# Altium schematic sheet driver_and_mosfets.SchDoc
size A4
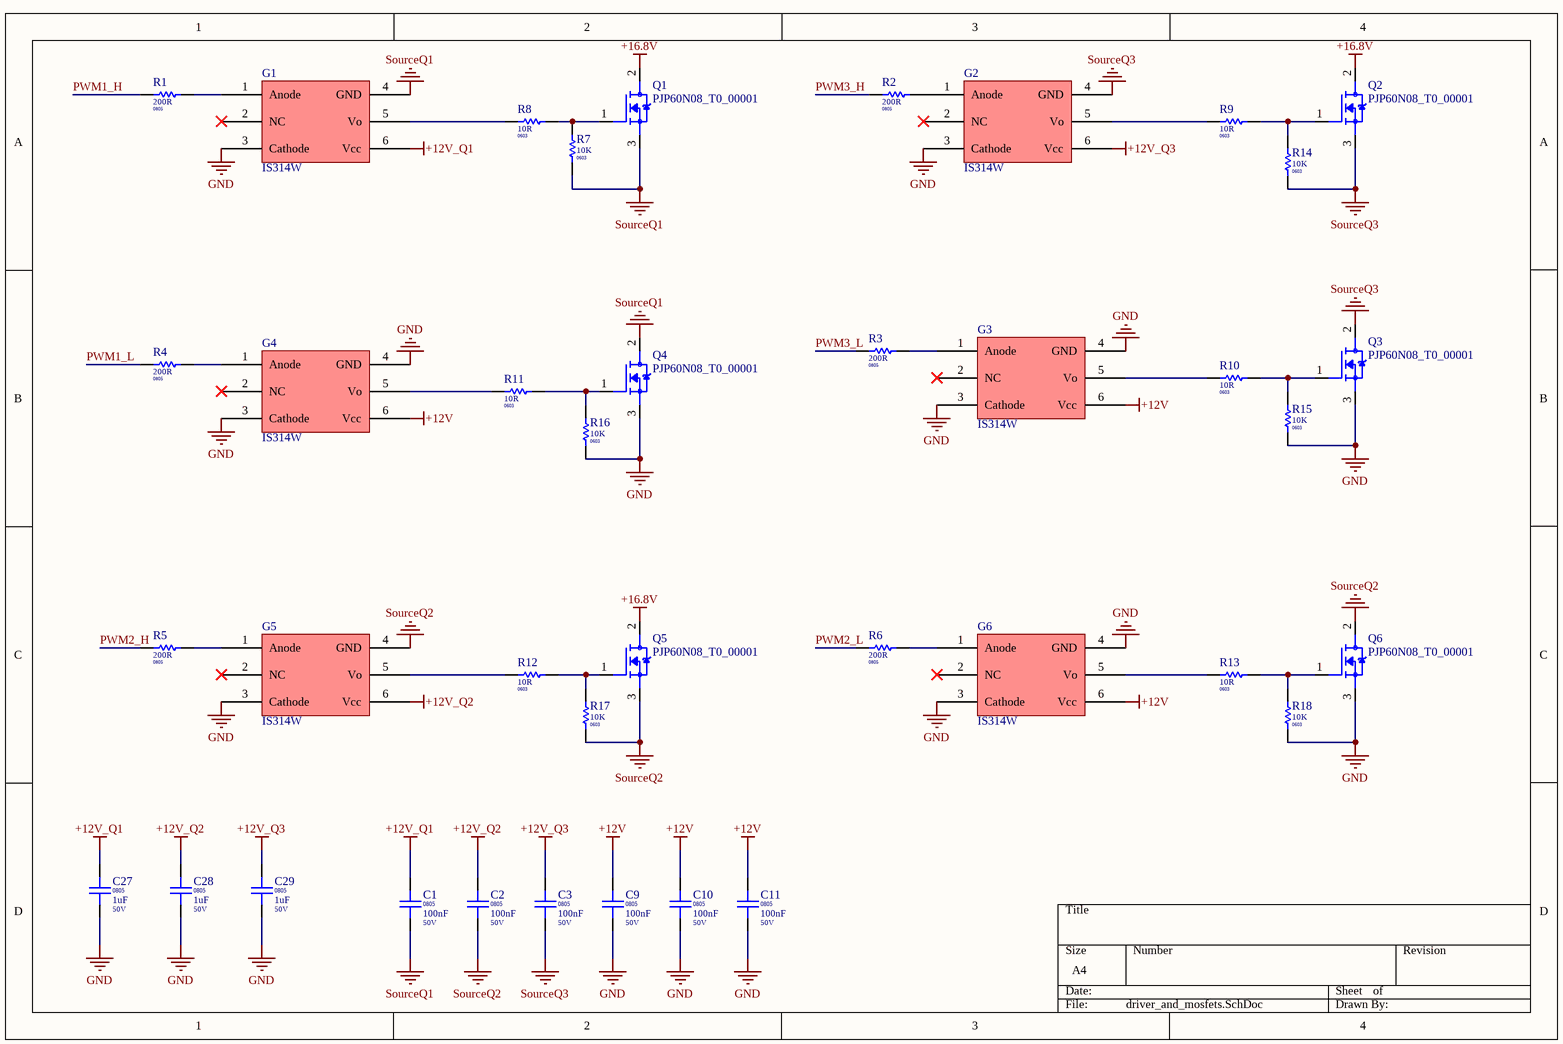
[diagram p0: driver_and_mosfets.SchDoc]

## Parts
C1  Package / Case: 0805  Voltage: 50V  [CAPC 0805]  (hidden comment: 100nF)
C2  Package / Case: 0805  Voltage: 50V  [CAPC 0805]  (hidden comment: 100nF)
C3  Package / Case: 0805  Voltage: 50V  [CAPC 0805]  (hidden comment: 100nF)
C9  Package / Case: 0805  Voltage: 50V  [CAPC 0805]  (hidden comment: 100nF)
C10  Package / Case: 0805  Voltage: 50V  [CAPC 0805]  (hidden comment: 100nF)
C11  Package / Case: 0805  Voltage: 50V  [CAPC 0805]  (hidden comment: 100nF)
C27  Package / Case: 0805  Voltage: 50V  [CAPC 0805]  (hidden comment: 1uF)
C28  Package / Case: 0805  Voltage: 50V  [CAPC 0805]  (hidden comment: 1uF)
C29  Package / Case: 0805  Voltage: 50V  [CAPC 0805]  (hidden comment: 1uF)
G1  IS314W  [SOIC127P1150X360-6N]
G2  IS314W  [SOIC127P1150X360-6N]
G3  IS314W  [SOIC127P1150X360-6N]
G4  IS314W  [SOIC127P1150X360-6N]
G5  IS314W  [SOIC127P1150X360-6N]
G6  IS314W  [SOIC127P1150X360-6N]
Q1  PJP60N08_T0_00001  [TO-220-3]
Q2  PJP60N08_T0_00001  [TO-220-3]
Q3  PJP60N08_T0_00001  [TO-220-3]
Q4  PJP60N08_T0_00001  [TO-220-3]
Q5  PJP60N08_T0_00001  [TO-220-3]
Q6  PJP60N08_T0_00001  [TO-220-3]
R1  Package / Case: 0805  [RESC 0805]  (hidden comment: 200R)
R2  Package / Case: 0805  [RESC 0805]  (hidden comment: 200R)
R3  Package / Case: 0805  [RESC 0805]  (hidden comment: 200R)
R4  Package / Case: 0805  [RESC 0805]  (hidden comment: 200R)
R5  Package / Case: 0805  [RESC 0805]  (hidden comment: 200R)
R6  Package / Case: 0805  [RESC 0805]  (hidden comment: 200R)
R7  Package / Case: 0603  [RESC 0603]  (hidden comment: 10K)
R8  Package / Case: 0603  [RESC 0603]  (hidden comment: 10R)
R9  Package / Case: 0603  [RESC 0603]  (hidden comment: 10R)
R10  Package / Case: 0603  [RESC 0603]  (hidden comment: 10R)
R11  Package / Case: 0603  [RESC 0603]  (hidden comment: 10R)
R12  Package / Case: 0603  [RESC 0603]  (hidden comment: 10R)
R13  Package / Case: 0603  [RESC 0603]  (hidden comment: 10R)
R14  Package / Case: 0603  [RESC 0603]  (hidden comment: 10K)
R15  Package / Case: 0603  [RESC 0603]  (hidden comment: 10K)
R16  Package / Case: 0603  [RESC 0603]  (hidden comment: 10K)
R17  Package / Case: 0603  [RESC 0603]  (hidden comment: 10K)
R18  Package / Case: 0603  [RESC 0603]  (hidden comment: 10K)

## Nets
+12V: C9.2 C10.2 C11.2 G3.6(Vcc) G4.6(Vcc) G6.6(Vcc)
+12V_Q1: C1.2 C27.2 G1.6(Vcc)
+12V_Q2: C2.2 C28.2 G5.6(Vcc)
+12V_Q3: C3.2 C29.2 G2.6(Vcc)
+16.8V: Q1.2(D) Q2.2(D) Q5.2(D)
GND: C9.1 C10.1 C11.1 C27.1 C28.1 C29.1 G1.3(Cathode) G2.3(Cathode) G3.3(Cathode) G3.4(GND) G4.3(Cathode) G4.4(GND) G5.3(Cathode) G6.3(Cathode) G6.4(GND) Q3.3(S) Q4.3(S) Q6.3(S) R15.1 R16.1 R18.1
SourceQ1: C1.1 G1.4(GND) Q1.3(S) Q4.2(D) R7.1
SourceQ2: C2.1 G5.4(GND) Q5.3(S) Q6.2(D) R17.1
SourceQ3: C3.1 G2.4(GND) Q2.3(S) Q3.2(D) R14.1
PWM1_H: R1.1
PWM1_L: R4.1
PWM2_H: R5.1
PWM2_L: R6.1
PWM3_H: R2.1
PWM3_L: R3.1
NetG1_1: G1.1(Anode) R1.2
NetG1_5: G1.5(Vo) R8.1
NetG2_1: G2.1(Anode) R2.2
NetG2_5: G2.5(Vo) R9.1
NetG3_1: G3.1(Anode) R3.2
NetG3_5: G3.5(Vo) R10.1
NetG4_1: G4.1(Anode) R4.2
NetG4_5: G4.5(Vo) R11.1
NetG5_1: G5.1(Anode) R5.2
NetG5_5: G5.5(Vo) R12.1
NetG6_1: G6.1(Anode) R6.2
NetG6_5: G6.5(Vo) R13.1
NetQ1_1: Q1.1(G) R7.2 R8.2
NetQ2_1: Q2.1(G) R9.2 R14.2
NetQ3_1: Q3.1(G) R10.2 R15.2
NetQ4_1: Q4.1(G) R11.2 R16.2
NetQ5_1: Q5.1(G) R12.2 R17.2
NetQ6_1: Q6.1(G) R13.2 R18.2

Not connected (* = marked no-connect by the designer): G1 2(NC)*; G2 2(NC)*; G3 2(NC)*; G4 2(NC)*; G5 2(NC)*; G6 2(NC)*

## Library data of the parts
C1-C3 C9-C11 = CAPC0572: Capacitor Ceramic 100nF 50V 0805; Tolerance: %10; Value Rating: nF; Favorites: Favorite; Value: 100nF; Part Number: CAPC0572; Category: Capacitor Ceramic; Values: 100nF 50V
C27-C29 = CAPC0580: Capacitor Ceramic 1uF 50V 0805; Tolerance: %10; Value Rating: uF; Values: 1uF 50V; Favorites: Favorite; Value: 1uF; Part Number: CAPC0580; Category: Capacitor Ceramic
G1-G6 = IS314W: IC-314 OPTO GATE DRVR 5KV SO6 STRETCHED
Q1-Q6 = PJP60N08_T0_00001: MOSFET DIS.60A 80V N-CH TO220AB SWITCH THT; MP: IRF520NPBF; MF: Infineon Technologies; Package: TO-220AB International Rectifier; Price: None; Availability: Unavailable; Value: *; SnapEDA_Link: https://www.snapeda.com/parts/IRF520NPBF/Infineon%20Technologies/view-part/106191/?ref=snap
R1-R6 = R0325: 200R 0805; Part Number: R0325; Tolerance: %5; Power: 1/10W; Value: 200R; Category: Resistor; Values: 200R
R7 R14-R18 = R0220: 10K 0603; Part Number: R0220; Tolerance: %5; Power: 1/10W; Value: 10K; Category: Resistor; Values: 10K
R8-R13 = R0149: 10R 0603; Part Number: R0149; Tolerance: %5; Power: 1/10W; Value: 10R; Category: Resistor; Values: 10R